# Altium project MIXR Input and Processing.PrjPcb (part 6 of 6)

## Sheet MIXR Processing - STM32 DSP Misc.SchDoc: STM32F767 DSP Microcontroller - Clock & Power
size B; Organization: Midnight Sun Solar Rayce Car Team; Address1: University of Waterloo; Address2: 200 University Ave W; Address3: Waterloo, ON, Canada; Address4: N2L 3E9; DocumentNumber: 11; SheetNumber: 11; SheetTotal: 15; Website: www.uwmidsun.com; ProjectName: ProjectName
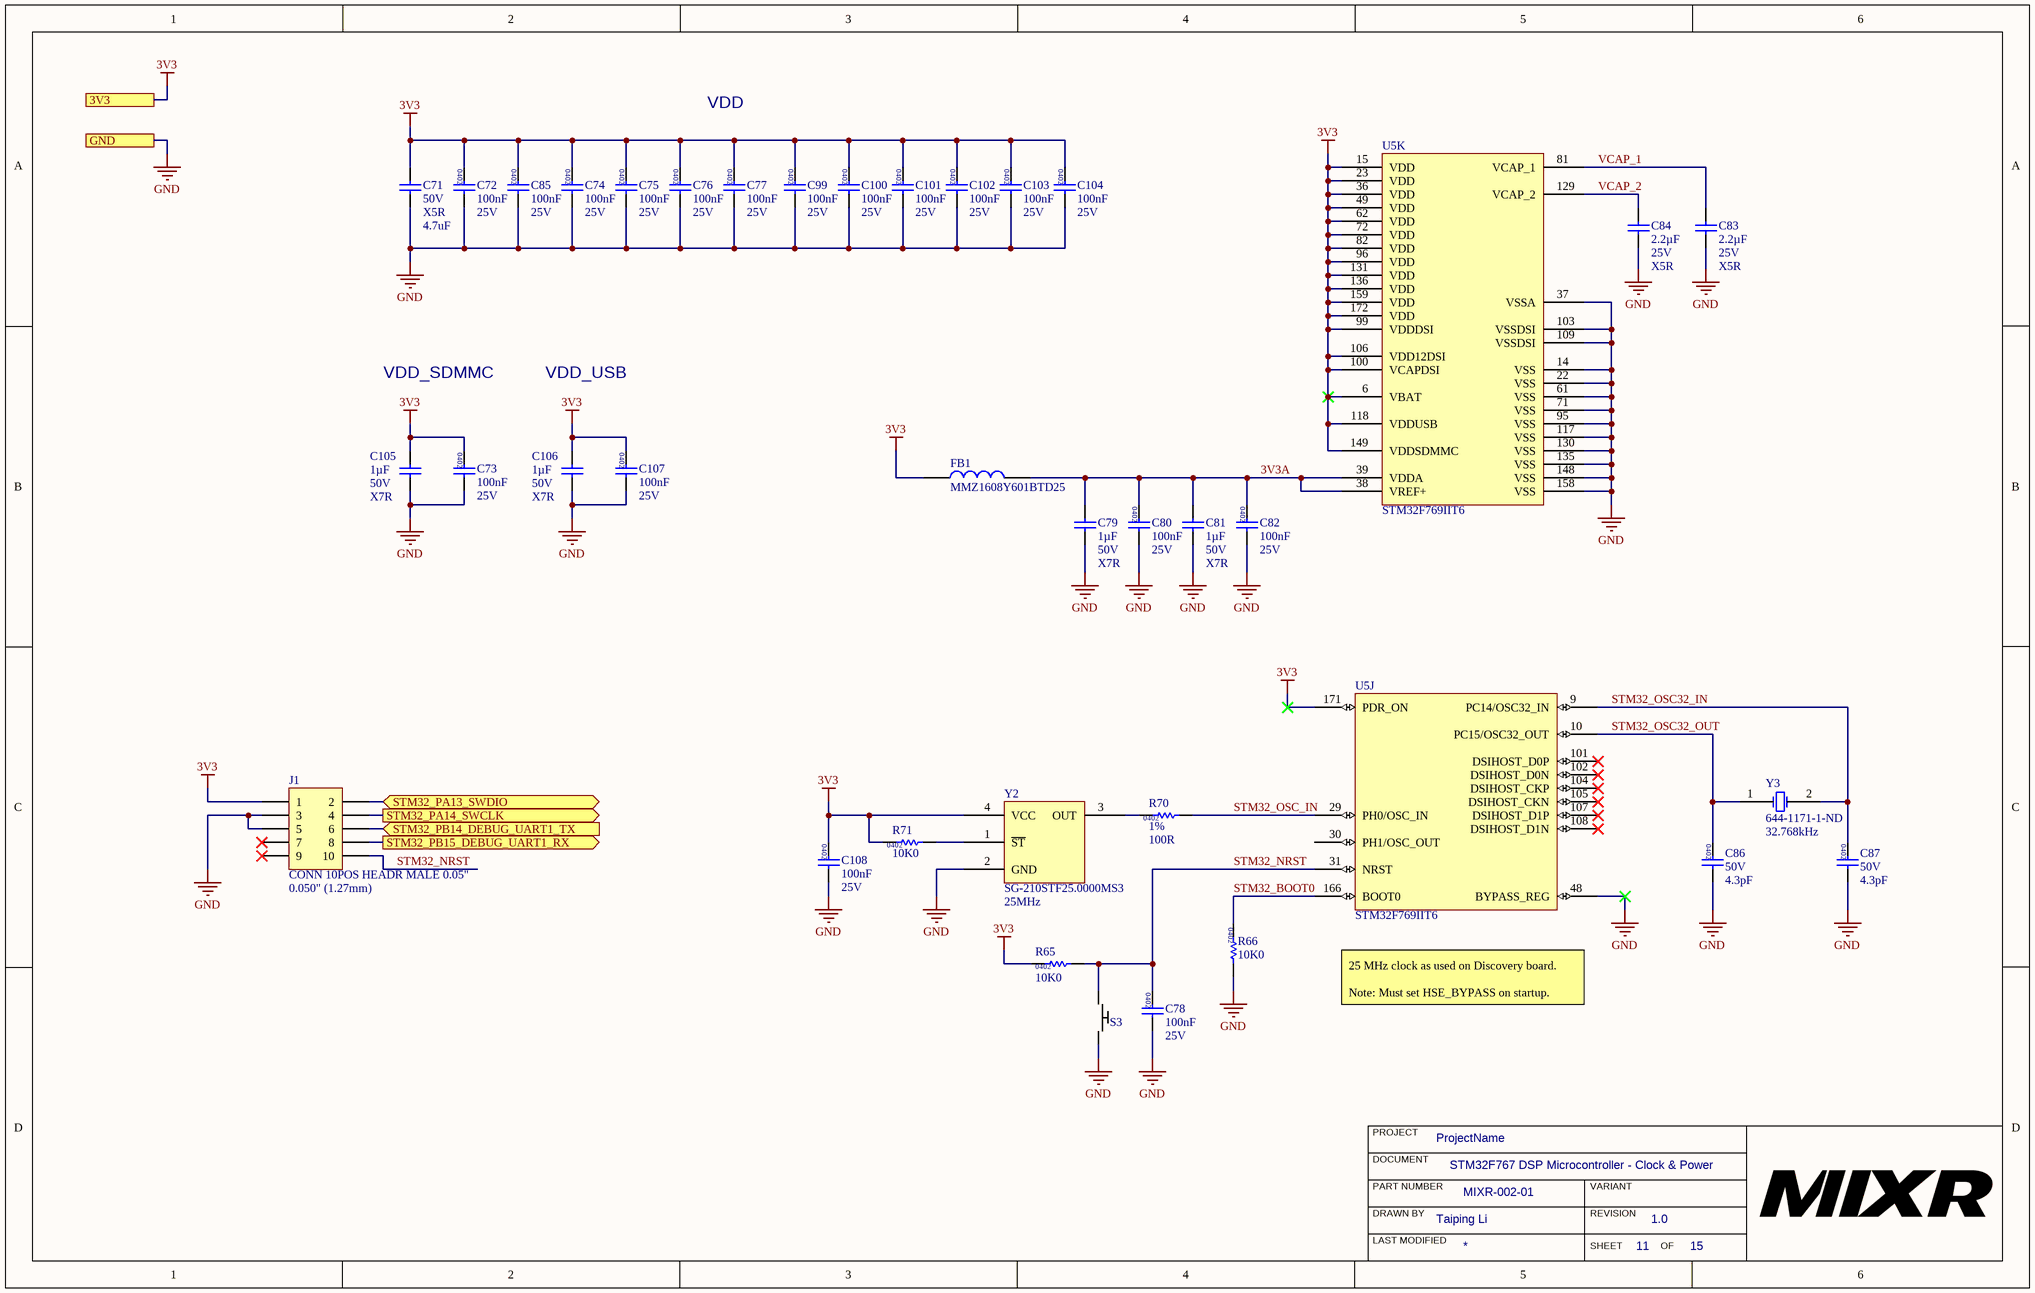
[diagram p11: MIXR Processing - STM32 DSP Misc.SchDoc]

### Parts
C71  value 4.7uF  Voltage - Rated: 50V  Temperature Coefficient: X5R  [CAP, 0805]  (hidden comment: CAP CER 4.7UF 50V 10% X5R 0805)
C72  Capacitance: 100nF  Voltage: 25V  [CAP 0402]  (hidden comment: CAP CER 0.1UF 16V X7R 0402)
C73  Capacitance: 100nF  Voltage: 25V  [CAP 0402]  (hidden comment: CAP CER 0.1UF 16V X7R 0402)
C74  Capacitance: 100nF  Voltage: 25V  [CAP 0402]  (hidden comment: CAP CER 0.1UF 16V X7R 0402)
C75  Capacitance: 100nF  Voltage: 25V  [CAP 0402]  (hidden comment: CAP CER 0.1UF 16V X7R 0402)
C76  Capacitance: 100nF  Voltage: 25V  [CAP 0402]  (hidden comment: CAP CER 0.1UF 16V X7R 0402)
C77  Capacitance: 100nF  Voltage: 25V  [CAP 0402]  (hidden comment: CAP CER 0.1UF 16V X7R 0402)
C78  Capacitance: 100nF  Voltage: 25V  [CAP 0402]  (hidden comment: CAP CER 0.1UF 16V X7R 0402)
C79  Capacitance: 1µF  Voltage: 50V  Temperature Coefficient: X7R  [CAP, 0603]  (hidden comment: CAP CER 1UF 50V 10% X7R 0603)
C80  Capacitance: 100nF  Voltage: 25V  [CAP 0402]  (hidden comment: CAP CER 0.1UF 16V X7R 0402)
C81  Capacitance: 1µF  Voltage: 50V  Temperature Coefficient: X7R  [CAP, 0603]  (hidden comment: CAP CER 1UF 50V 10% X7R 0603)
C82  Capacitance: 100nF  Voltage: 25V  [CAP 0402]  (hidden comment: CAP CER 0.1UF 16V X7R 0402)
C83  Capacitance: 2.2µF  Voltage: 25V  Temperature Coefficient: X5R  [CAP, 0603]  (hidden comment: CAP CER 2.2UF 25V 10% X5R 0603)
C84  Capacitance: 2.2µF  Voltage: 25V  Temperature Coefficient: X5R  [CAP, 0603]  (hidden comment: CAP CER 2.2UF 25V 10% X5R 0603)
C85  Capacitance: 100nF  Voltage: 25V  [CAP 0402]  (hidden comment: CAP CER 0.1UF 16V X7R 0402)
C86  Voltage Rating: 50V  Capacitance: 4.3pF  [CAP 0402]  (hidden comment: CAP CER 4.3PF 50V C0G/NPO 0402)
C87  Voltage Rating: 50V  Capacitance: 4.3pF  [CAP 0402]  (hidden comment: CAP CER 4.3PF 50V C0G/NPO 0402)
C99  Capacitance: 100nF  Voltage: 25V  [CAP 0402]  (hidden comment: CAP CER 0.1UF 16V X7R 0402)
C100  Capacitance: 100nF  Voltage: 25V  [CAP 0402]  (hidden comment: CAP CER 0.1UF 16V X7R 0402)
C101  Capacitance: 100nF  Voltage: 25V  [CAP 0402]  (hidden comment: CAP CER 0.1UF 16V X7R 0402)
C102  Capacitance: 100nF  Voltage: 25V  [CAP 0402]  (hidden comment: CAP CER 0.1UF 16V X7R 0402)
C103  Capacitance: 100nF  Voltage: 25V  [CAP 0402]  (hidden comment: CAP CER 0.1UF 16V X7R 0402)
C104  Capacitance: 100nF  Voltage: 25V  [CAP 0402]  (hidden comment: CAP CER 0.1UF 16V X7R 0402)
C105  Capacitance: 1µF  Voltage: 50V  Temperature Coefficient: X7R  [CAP, 0603]  (hidden comment: CAP CER 1UF 50V 10% X7R 0603)
C106  Capacitance: 1µF  Voltage: 50V  Temperature Coefficient: X7R  [CAP, 0603]  (hidden comment: CAP CER 1UF 50V 10% X7R 0603)
C107  Capacitance: 100nF  Voltage: 25V  [CAP 0402]  (hidden comment: CAP CER 0.1UF 16V X7R 0402)
C108  Capacitance: 100nF  Voltage: 25V  [CAP 0402]  (hidden comment: CAP CER 0.1UF 16V X7R 0402)
FB1  Manufacturer Part Number: MMZ1608Y601BTD25  [FB 0603]  (hidden comment: FB 600 OHM 1LN 0603)
J1  CONN 10POS HEADR MALE 0.05"  Pitch - Mating: 0.050" (1.27mm)  [CONN, 10POS 0.05" Debug Header]
R65  Resistance: 10K0  [RES 0402]  (hidden comment: RES 10K OHM 1% 1/16W 0402)
R66  Resistance: 10K0  [RES 0402]  (hidden comment: RES 10K OHM 1% 1/16W 0402)
R70  Tolerance: 1%  Resistance: 100R  [RES 0402]  (hidden comment: RES 100 OHM 1% 1/16W 0402)
R71  Resistance: 10K0  [RES 0402]  (hidden comment: RES 10K OHM 1% 1/16W 0402)
S3  SPST  [SW SPST-NO 0.05A 12V]  (value not drawn)
U5  Manufacturer Part Number: STM32F769IIT6  [TSQFP50P2600X2600X160-176M]  (hidden comment: IC MCU STM32F769II 176-LQFP)  (parts J,K of 11)
Y2  Manufacturer Part Number: SG-210STF25.0000MS3  Frequency: 25MHz  [CRYSTAL 25 MHz OSC XO CMOS SMD]  (hidden comment: CRYSTAL 25 MHz OSC XO CMOS SMD)
Y3  Supplier Part Number 1: 644-1171-1-ND  Frequency: 32.768kHz  [CRYSTAL 32.7680 KHZ 6PF 2-SMD]  (hidden comment: CRYSTAL 32.7680 KHZ 6PF 2-SMD)

### Ports
3V3, GND, STM32_PA13_SWDIO (bidir), STM32_PA14_SWCLK (out), STM32_PB14_DEBUG_UART1_TX (in), STM32_PB15_DEBUG_UART1_RX (out)

### Nets
3V3: C71.1 C72.1 C73.1 C74.1 C75.1 C76.1 C77.1 C85.1 C99.1 C100.1 C101.1 C102.1 C103.1 C104.1 C105.1 C106.1 C107.1 C108.1 FB1.1 J1.1 R65.1 R71.1 U5.6(VBAT) U5.15(VDD) U5.23(VDD) U5.36(VDD) U5.49(VDD) U5.62(VDD) U5.72(VDD) U5.82(VDD) U5.96(VDD) U5.99(VDDDSI) U5.100(VCAPDSI) U5.106(VDD12DSI) U5.118(VDDUSB) U5.131(VDD) U5.136(VDD) U5.149(VDDSDMMC) U5.159(VDD) U5.171(PDR_ON) U5.172(VDD) Y2.4(VCC) ; port 3V3
GND: C71.2 C72.2 C73.2 C74.2 C75.2 C76.2 C77.2 C78.2 C79.2 C80.2 C81.2 C82.2 C83.2 C84.2 C85.2 C86.2 C87.2 C99.2 C100.2 C101.2 C102.2 C103.2 C104.2 C105.2 C106.2 C107.2 C108.2 J1.3 J1.5 R66.2 S3.2 U5.14(VSS) U5.22(VSS) U5.37(VSSA) U5.48(BYPASS_REG) U5.61(VSS) U5.71(VSS) U5.95(VSS) U5.103(VSSDSI) U5.109(VSSDSI) U5.117(VSS) U5.130(VSS) U5.135(VSS) U5.148(VSS) U5.158(VSS) Y2.2(GND) ; port GND
3V3A: C79.1 C80.1 C81.1 C82.1 FB1.2 U5.38(VREF+) U5.39(VDDA)
STM32_BOOT0: R66.1 U5.166(BOOT0)
STM32_NRST: C78.1 J1.10 R65.2 S3.1 U5.31(NRST)
STM32_OSC32_IN: C87.1 U5.9(PC14/OSC32_IN) Y3.2
STM32_OSC32_OUT: C86.1 U5.10(PC15/OSC32_OUT) Y3.1
STM32_OSC_IN: R70.2 U5.29(PH0/OSC_IN)
STM32_PA13_SWDIO: J1.2 ; port STM32_PA13_SWDIO
STM32_PA14_SWCLK: J1.4 ; port STM32_PA14_SWCLK
STM32_PB14_DEBUG_UART1_TX: J1.6 ; port STM32_PB14_DEBUG_UART1_TX
STM32_PB15_DEBUG_UART1_RX: J1.8 ; port STM32_PB15_DEBUG_UART1_RX
VCAP_1: C83.1 U5.81(VCAP_1)
VCAP_2: C84.1 U5.129(VCAP_2)
NetR70_1: R70.1 Y2.3(OUT)
NetR71_2: R71.2 Y2.1(~{ST})

Not connected (* = marked no-connect by the designer): J1 7* 9*; U5 30(PH1/OSC_OUT) 101(DSIHOST_D0P)* 102(DSIHOST_D0N)* 104(DSIHOST_CKP)* 105(DSIHOST_CKN)* 107(DSIHOST_D1P)* 108(DSIHOST_D1N)*

### Notes on the sheet
- VDD
- VDD_SDMMC
- VDD_USB
- 25 MHz clock as used on Discovery board.
  Note: Must set HSE_BYPASS on startup.
- PROJECT
- DOCUMENT
- DRAWN BY
- LAST MODIFIED
- PART NUMBER
- REVISION
- SHEET
- VARIANT
- OF

### Library data of the parts
C71 = CAP CER 4.7UF 50V 10% X5R 0805: 4.7µF ±20% 50V Ceramic Capacitor X5R 0805 (2012 Metric); Manufacturer 1: Murata Electronics North America; Manufacturer Part Number 1: GRT21BR61H475ME13L; Description 1: CAP CER 4.7UF 50V X5R 0805; Supplier 1: Digi-Key; Supplier Part Number 1: 490-12395-1-ND; RoHS: RoHS Compliant; Category: Capacitors; Stock 1: 4286; Pricing 1: 1=0.56, 10=0.389, 100=0.2338, 500=0.17536, 1000=0.14808 (CAD); Packaging: Cut Tape (CT); Part Status: Active; Tolerance: ±20%; Operating Temperature: -55°C ~ 85°C; Features: -; Ratings: AEC-Q200; Applications: Automotive; Mounting Type: Surface Mount, MLCC; Package / Case: 0805 (2012 Metric); Size / Dimension: 0.079" L x 0.049" W (2.00mm x 1.25mm); Height - Seated (Max): -; Thickness (Max): 0.057" (1.45mm); Lead Spacing: -; Lead Style: -; ComponentLink1URL: http://search.murata.co.jp/Ceramy/image/img/A01X/G101/ENG/GRT21BR61H475ME13-01.pdf; ComponentLink1Description: http://search.murata.co.jp/Ceramy/image/img/A01X/G101/ENG/GRT21BR61H475ME13-01.pdf
C72-C78 C80 C82 C85 C99-C104 C107 C108 = CAP CER 0.1UF 16V X7R 0402: as C2-C7 on sheet MIXR Processing - ESP32; Supplier 1: Digi-Key; Supplier Part Number 1: 490-10698-1-ND; Packaging: Tape and Reel; ComponentLink1URL: http://www.farnell.com/datasheets/2048008.pdf?src-supplier=Farnell; ComponentLink1Description: http://www.farnell.com/datasheets/2048008.pdf?src-supplier=Farnell; Tolerance: 10%; RoHS: Yes; Category: Ceramic Capacitors; Stock 1: 785540; Pricing 1: 1=0.10000, 10=0.03400, 100=0.01520, 500=0.01088, 1000=0.00855, 2500=0.00778, 5000=0.00715 (USD); Mount: Surface Mount; Case/Package: 0402; Weight: 0.000212oz; Case Code (Metric): 1005; Case Code (Imperial): 0402; Dielectric Material: Ceramic; Min Operating Temperature: -55°C; Max Operating Temperature: 125°C; Termination: SMD/SMT; Composition: Ceramic; Package Quantity: 10000; Length: 1mm; Height: 0.5mm; Width: 0.02inch; Thickness: 0.022inch; Depth: 0.5mm; REACH SVHC: Unknown; Lead Free: Lead Free; ComponentLink2URL: http://uk.rs-online.com/webdocs/144c/0900766b8144c113.pdf?src-supplier=RSComponents; ComponentLink2Description: http://uk.rs-online.com/webdocs/144c/0900766b8144c113.pdf?src-supplier=RSComponents; ComponentLink3URL: http://www.farnell.com/datasheets/1872206.pdf?src-supplier=Farnell; ComponentLink3Description: http://www.farnell.com/datasheets/1872206.pdf?src-supplier=Farnell; ComponentLink4URL: http://components.arrow.com/part/dataview/0323_06361249?src-supplier=Arrow+Europe; ComponentLink4Description: http://components.arrow.com/part/dataview/0323_06361249?src-supplier=Arrow+Europe; ComponentLink5URL: http://www.mouser.com/ds/2/281/c02e-2905.pdf?src-supplier=Mouser; ComponentLink5Description: http://www.mouser.com/ds/2/281/c02e-2905.pdf?src-supplier=Mouser; ComponentLink6URL: http://www.farnell.com/datasheets/2048008.pdf?src-supplier=Newark; ComponentLink6Description: http://www.farnell.com/datasheets/2048008.pdf?src-supplier=Newark; ComponentLink7URL: http://psearch.en.murata.com/capacitor/product/GRM155R71E104KE14%23.pdf?src-supplier=Avnet; ComponentLink7Description: http://psearch.en.murata.com/capacitor/product/GRM155R71E104KE14%23.pdf?src-supplier=Avnet; ComponentLink8URL: https://search.murata.co.jp/Ceramy/image/img/A01X/G101/ENG/GRM155R71E104KE14-01.pdf?src-supplier=Digi-Key; ComponentLink8Description: https://search.murata.co.jp/Ceramy/image/img/A01X/G101/ENG/GRM155R71E104KE14-01.pdf?src-supplier=Digi-Key; ComponentLink9URL: http://www.farnell.com/datasheets/2048008.pdf?src-supplier=Element14; ComponentLink9Description: http://www.farnell.com/datasheets/2048008.pdf?src-supplier=Element14; Dielectric: X7R; Voltage Rating (DC): 25V; Voltage Rating: 25V
C79 C81 C105 C106 = CAP CER 1UF 50V 10% X7R 0603: 1µF ±10% 50V Ceramic Capacitor X7R 0603 (1608 Metric); Manufacturer 1: Taiyo Yuden; Manufacturer Part Number 1: UMK107AB7105KA-T; Supplier 1: Digi-Key; Supplier Part Number 1: 587-3247-1-ND; Packaging: Cut Tape (CT); Part Status: Active; Operating Temperature: -55°C ~ 125°C; Ratings: -; Mounting Type: Surface Mount, MLCC; Package / Case: 0603 (1608 Metric); Size / Dimension: 0.063" L x 0.031" W (1.60mm x 0.80mm); Height - Seated (Max): -; Thickness (Max): 0.037" (0.95mm); Lead Spacing: -; Lead Style: -; ComponentLink1URL: http://www.yuden.co.jp/productdata/catalog/en/mlcc_all_e.pdf; ComponentLink1Description: http://www.yuden.co.jp/productdata/catalog/en/mlcc_all_e.pdf; Tolerance: ±10%
C83 C84 = CAP CER 2.2UF 25V 10% X5R 0603: 2.2µF ±10% 25V Ceramic Capacitor X5R 0603 (1608 Metric); Manufacturer 1: Murata Electronics North America; Manufacturer Part Number 1: GRM188R61E225KA12D; Supplier 1: Digi-Key; Supplier Part Number 1: 490-10731-1-ND; Packaging: Cut Tape (CT); Part Status: Active; Operating Temperature: -55°C ~ 85°C; Ratings: -; Mounting Type: Surface Mount, MLCC; Package / Case: 0603 (1608 Metric); Size / Dimension: 0.063" L x 0.031" W (1.60mm x 0.80mm); Height - Seated (Max): -; Thickness (Max): 0.035" (0.90mm); Lead Spacing: -; Lead Style: -; ComponentLink1URL: http://www.murata.com/~/media/webrenewal/support/library/catalog/products/capacitor/mlcc/c02e.ashx; ComponentLink1Description: http://www.murata.com/~/media/webrenewal/support/library/catalog/products/capacitor/mlcc/c02e.ashx; Tolerance: ±10%
C86 C87 = CAP CER 4.3PF 50V C0G/NPO 0402: Multilayer Ceramic Capacitors MLCC - SMD/SMT 0402 4.3pF 50Volts C0G +/-0.1pF; Manufacturer: Murata; Manufacturer Part Number: GJM1555C1H4R3BB01D; Supplier 1: Digi-Key; RoHS: Yes; Category: Ceramic Capacitors; Stock 1: 18899; Pricing 1: 1=0.19000, 10=0.13000, 100=0.06590, 500=0.04508, 1000=0.03987, 2500=0.03814, 5000=0.03467 (USD); Mount: Surface Mount; Case/Package: 0402; Case Code (Metric): 1005; Case Code (Imperial): 0402; Min Operating Temperature: -55°C; Max Operating Temperature: 125°C; Package Quantity: 10000; Packaging: Tape and Reel; Dielectric: C0G; Voltage Rating (DC): 50V; Termination: SMD/SMT; Length: 1mm; Height: 0.5mm; Width: 0.02inch; Thickness: 0.022inch; Depth: 0.5mm; Radiation Hardening: No; ComponentLink1URL: https://datasheet.ciiva.com/11613/product-11613476.pdf?src-supplier=Avnet; ComponentLink1Description: https://datasheet.ciiva.com/11613/product-11613476.pdf?src-supplier=Avnet; ComponentLink2URL: https://datasheet.ciiva.com/29536/partnumbering-e-01-29536085.pdf?src-supplier=Digi-Key; ComponentLink2Description: https://datasheet.ciiva.com/29536/partnumbering-e-01-29536085.pdf?src-supplier=Digi-Key; ComponentLink3URL: https://datasheet.ciiva.com/29536/partnumbering-e-01-29536086.pdf?src-supplier=Digi-Key; ComponentLink3Description: https://datasheet.ciiva.com/29536/partnumbering-e-01-29536086.pdf?src-supplier=Digi-Key; Supplier Part Number 1: 490-8582-1-ND
FB1 = FB 600 OHM 1LN 0603: FERRITE BEAD 600 OHM 0603 1LN; Manufacturer: TDK; Number of Lines: 1; Max Current Rating: 500mA; DC Resistance (DCR): 400mR; Impedance: 600R; Tolerance: 25%; Test Frequency: 100MHz; Supplier 1: Digi-Key; Supplier Part Number 1: 445-172850-1-ND; RoHS: Yes; Stock 1: 19540; Pricing 1: 1 = 0.10000, 10 = 0.07600, 25 = 0.06840, 50 = 0.05000, 100 = 0.04330, 250 = 0.03416, 500 = 0.02884, 1000 = 0.02429 (USD); Mount: Surface Mount; Case/Package: 0603; Weight: 7.1E-05oz; Case Code (Metric): 1608; Case Code (Imperial): 0603; Min Operating Temperature: -55°C; Max Operating Temperature: 125°C; Package Quantity: 4000; Packaging: Tape and Reel; Termination: SMD/SMT; Max DC Current: 500mA; Length: 0.063inch; Height: 0.037inch; Width: 0.031inch; Ratings: AEC-Q200
J1 = CONN 10POS HEADR MALE 0.05": 10 Positions Header Connector 0.050" (1.27mm) Surface Mount Gold; Manufacturer 1: Amphenol FCI; Manufacturer Part Number 1: 20021121-00010C4LF; Style: Board to Board; Shrouding: Unshrouded; Number of Positions: 10; Number of Positions Loaded: All; Contact Length - Mating: 0.120" (3.05mm); Material Flammability Rating: UL94 V-0; Supplier 1: Digi-Key; Supplier Part Number 1: 609-3695-1-ND; Packaging: Cut Tape (CT); Part Status: Active; Connector Type: Header; Contact Type: Male Pin; Number of Rows: 2; Row Spacing - Mating: 0.050" (1.27mm); Mounting Type: Surface Mount; Termination: Solder; Fastening Type: -; Contact Length - Post: -; Overall Contact Length: -; Insulation Height: -; Contact Shape: Square; Contact Finish - Mating: Gold; Contact Finish Thickness - Mating: 10µin (0.25µm); Contact Finish - Post: Tin; Contact Material: Copper Alloy; Insulation Material: Thermoplastic; Operating Temperature: -; Ingress Protection: -; Insulation Color: Black; Current Rating: -; Mated Stacking Heights: -; Contact Finish Thickness - Post: 50µin (1.27µm); ComponentLink1URL: http://portal.fciconnect.com/Comergent//fci/drawing/20021121.pdf; ComponentLink1Description: http://portal.fciconnect.com/Comergent//fci/drawing/20021121.pdf; Voltage: -
R65 R66 R71 = RES 10K OHM 1% 1/16W 0402: Surface Mount Thick Film Resistor, Rc Series, 10 Kohm, 62.5 Mw, - 1%, 50 V, 0402 [1005 Metric]; Manufacturer: Yageo; Manufacturer Part Number: RC0402FR-0710KL; Temperature Coefficient: 100ppm/°C; Voltage Rating: 50V; Power Rating: 62.5mW; Supplier 1: Digi-Key; Supplier Part Number 1: 311-10.0KLRCT-ND; Packaging: Tape and Reel; Composition: Thick Film; ComponentLink1URL: https://datasheet.ciiva.com/7660/38568-7660787.pdf?src-supplier=Element14; ComponentLink1Description: https://datasheet.ciiva.com/7660/38568-7660787.pdf?src-supplier=Element14; Tolerance: 1%; RoHS: Yes; Category: Chip SMD Resistors; Stock 1: 60761136; Pricing 1: 1=0.10000, 10=0.01600, 100=0.00640, 1000=0.00289, 2500=0.00251, 5000=0.00207 (USD); Case/Package: 0402; Number of Pins: 2; Case Code (Imperial): 0402; Case Code (Metric): 1005; Min Operating Temperature: -55°C; Max Operating Temperature: 155°C; Voltage Rating (DC): 50V; Termination: SMD/SMT; Military Standard: Not; Working Voltage: 50V; Number of Terminations: 2; Length: 1mm; Height: 0.32mm; Width: 0.5mm; Depth: 0.5mm; Lead Pitch: 0.2mm; REACH SVHC: No SVHC; Lead Free: Lead Free; ComponentLink2URL: https://datasheet.ciiva.com/7983/1018594-7983486.pdf?src-supplier=Element14; ComponentLink2Description: https://datasheet.ciiva.com/7983/1018594-7983486.pdf?src-supplier=Element14; ComponentLink3URL: https://datasheet.ciiva.com/7849/1784430-7849813.pdf?src-supplier=Element14; ComponentLink3Description: https://datasheet.ciiva.com/7849/1784430-7849813.pdf?src-supplier=Element14; ComponentLink4URL: https://datasheet.ciiva.com/7849/1686128-7849814.pdf?src-supplier=Element14; ComponentLink4Description: https://datasheet.ciiva.com/7849/1686128-7849814.pdf?src-supplier=Element14; ComponentLink5URL: https://datasheet.ciiva.com/7849/1784430-7849815.pdf?src-supplier=Element14; ComponentLink5Description: https://datasheet.ciiva.com/7849/1784430-7849815.pdf?src-supplier=Element14; ComponentLink6URL: https://datasheet.ciiva.com/22747/1018594-22747512.pdf?src-supplier=Element14; ComponentLink6Description: https://datasheet.ciiva.com/22747/1018594-22747512.pdf?src-supplier=Element14; ComponentLink7URL: https://datasheet.ciiva.com/12667/pyu-rc0402-51-rohs-l-6-r-12667067.pdf?src-supplier=Mouser; ComponentLink7Description: https://datasheet.ciiva.com/12667/pyu-rc0402-51-rohs-l-6-r-12667067.pdf?src-supplier=Mouser
R70 = RES 100 OHM 1% 1/16W 0402: 100 Ohms ±1% 0.063W, 1/16W Chip Resistor 0402 (1005 Metric) Moisture Resistant Thick Film; Manufacturer: Yageo; Manufacturer Part Number: RC0402FR-07100RL; Power Rating: 62.5mW; Voltage Rating: 50V; Temperature Coefficient: 100ppm/°C; Supplier 1: Digi-Key; RoHS: Yes; Category: Chip SMD Resistors; Stock 1: 42351567; Pricing 1: 1=0.10000, 10=0.01600, 100=0.00640, 1000=0.00289, 2500=0.00251, 5000=0.00207 (USD); Case/Package: 0402; Number of Pins: 2; Case Code (Imperial): 0402; Case Code (Metric): 1005; Min Operating Temperature: -55°C; Max Operating Temperature: 155°C; Packaging: Tape and Reel; Termination: SMD/SMT; Composition: Thick Film; Military Standard: Not; Voltage Rating (DC): 50V; Length: 1mm; Height: 0.32mm; Depth: 0.5mm; Width: 0.5mm; REACH SVHC: No SVHC; Lead Free: Lead Free; ComponentLink1URL: https://datasheet.ciiva.com/7849/1784430-7849810.pdf?src-supplier=Element14; ComponentLink1Description: https://datasheet.ciiva.com/7849/1784430-7849810.pdf?src-supplier=Element14; ComponentLink2URL: https://datasheet.ciiva.com/11808/0900766b80c66297-11808765.pdf?src-supplier=RSComponents; ComponentLink2Description: https://datasheet.ciiva.com/11808/0900766b80c66297-11808765.pdf?src-supplier=RSComponents; ComponentLink3URL: https://datasheet.ciiva.com/22747/1018594-22747511.pdf?src-supplier=Element14; ComponentLink3Description: https://datasheet.ciiva.com/22747/1018594-22747511.pdf?src-supplier=Element14; ComponentLink4URL: https://datasheet.ciiva.com/12667/pyu-rc0402-51-rohs-l-6-r-12667957.pdf?src-supplier=Mouser; ComponentLink4Description: https://datasheet.ciiva.com/12667/pyu-rc0402-51-rohs-l-6-r-12667957.pdf?src-supplier=Mouser; ComponentLink5URL: https://datasheet.ciiva.com/16740/pyu-rc0402-51-rohs-l-6-r-16740566.pdf?src-supplier=Future+Electronics; ComponentLink5Description: https://datasheet.ciiva.com/16740/pyu-rc0402-51-rohs-l-6-r-16740566.pdf?src-supplier=Future+Electronics; ComponentLink6URL: https://datasheet.ciiva.com/15189/getdatasheetpartid-329466-15189335.pdf?src-supplier=Verical; ComponentLink6Description: https://datasheet.ciiva.com/15189/getdatasheetpartid-329466-15189335.pdf?src-supplier=Verical; ComponentLink7URL: https://datasheet.ciiva.com/28367/1018594-28367226.pdf?src-supplier=Element14; ComponentLink7Description: https://datasheet.ciiva.com/28367/1018594-28367226.pdf?src-supplier=Element14; Supplier Part Number 1: 311-100LRCT-ND
S3 = SW SPST-NO 0.05A 12V: SWITCH TACTILE SPST-NO 50MA 12V; Manufacturer: E-Switch; Manufacturer Part Number: TL3305AF260QG; Mechanical Life: 200000Cycles; Illumination Type: Non-Illuminated; Operating Force: 260gf; Switch Travel: 0.2mm; Switch Function: Off-Mom; Actuator Type: Standard; Supplier 1: Digi-Key; RoHS: Yes; Category: Tactile Switches; Stock 1: 10795; Pricing 1: 1=0.20000, 10=0.19500, 25=0.18800, 50=0.18120, 100=0.17110, 250=0.16104, 500=0.15434, 1000=0.11743 (USD); Mount: Surface Mount; Min Operating Temperature: -20°C; Max Operating Temperature: 70°C; Packaging: Tape and Reel; Termination: Gull Wing; Throw Configuration: SPST; Lead Free: Lead Free; ComponentLink1URL: http://www.farnell.com/datasheets/2554191.pdf?src-supplier=Farnell; ComponentLink1Description: http://www.farnell.com/datasheets/2554191.pdf?src-supplier=Farnell; ComponentLink2URL: http://spec_sheets.e-switch.com/specs/P010471.pdf?src-supplier=Newark; ComponentLink2Description: http://spec_sheets.e-switch.com/specs/P010471.pdf?src-supplier=Newark; ComponentLink3URL: http://spec_sheets.e-switch.com/specs/P010471.pdf?src-supplier=Future+Electronics; ComponentLink3Description: http://spec_sheets.e-switch.com/specs/P010471.pdf?src-supplier=Future+Electronics; ComponentLink4URL: http://spec_sheets.e-switch.com/specs/P010471.pdf?src-supplier=Digi-Key; ComponentLink4Description: http://spec_sheets.e-switch.com/specs/P010471.pdf?src-supplier=Digi-Key; ComponentLink5URL: http://spec_sheets.e-switch.com/specs/P010471.pdf?src-supplier=Mouser; ComponentLink5Description: http://spec_sheets.e-switch.com/specs/P010471.pdf?src-supplier=Mouser; ComponentLink6URL: http://spec_sheets.e-switch.com/specs/P010471.pdf?src-supplier=NAC+Semi; ComponentLink6Description: http://spec_sheets.e-switch.com/specs/P010471.pdf?src-supplier=NAC+Semi; Supplier Part Number 1: EG5353CT-ND
U5 = IC MCU STM32F769II 176-LQFP: ARM® Cortex®-M7 STM32F7 Microcontroller IC 32-Bit 216MHz 2MB (2M x 8) FLASH 176-LQFP (24x24); Manufacturer: STMicroelectronics; Supplier 1: Digi-Key; RoHS: No; Category: Microcontrollers; Stock 1: 295; Pricing 1: 1=12.69000, 10=11.66300, 25=11.18000, 100=9.85040, 250=9.36696, 500=8.76264, 1000=8.03746 (USD); ComponentLink1URL: http://www.st.com/content/ccc/resource/technical/document/errata_sheet/group0/23/a6/11/0b/30/24/46/a5/DM00257543/files/DM00257543.pdf/jcr:content/translations/en.DM00257543.pdf?src-supplier=Digi-Key; ComponentLink1Description: http://www.st.com/content/ccc/resource/technical/document/errata_sheet/group0/23/a6/11/0b/30/24/46/a5/DM00257543/files/DM00257543.pdf/jcr:content/translations/en.DM00257543.pdf?src-supplier=Digi-Key; Supplier Part Number 1: 497-16649-ND
Y2 = CRYSTAL 25 MHz OSC XO CMOS SMD: XTAL OSC XO 25.0000MHZ CMOS SMD; Manufacturer: Epson; Max Supply Current: 2.2mA; Frequency Stability: 25ppm; Load Capacitance: 15pF; Min Supply Voltage: 1.6V; Max Supply Voltage: 3.6V; Max Duty Cycle: 55%; Supplier 1: Digi-Key; RoHS: Yes; Category: Oscillators; Stock 1: 1693; Pricing 1: 1=1.21000, 10=1.15900, 50=1.13200, 100=0.97020 (USD); Mount: Surface Mount; Case/Package: SMD/SMT; Min Operating Temperature: -20°C; Max Operating Temperature: 70°C; Package Quantity: 250; Packaging: Tape and Reel; Termination: SMD/SMT; Current Rating: 2.2mA; Length: 0.098inch; Height: 0.035inch; Width: 0.079inch; Lead Free: Lead Free; ComponentLink1URL: https://datasheet.ciiva.com/29629/029-sg-210stf-e147-29629845.pdf?src-supplier=Digi-Key; ComponentLink1Description: https://datasheet.ciiva.com/29629/029-sg-210stf-e147-29629845.pdf?src-supplier=Digi-Key; ComponentLink2URL: https://datasheet.ciiva.com/29629/029-sg-210stf-e147-29629799.pdf?src-supplier=Digi-Key; ComponentLink2Description: https://datasheet.ciiva.com/29629/029-sg-210stf-e147-29629799.pdf?src-supplier=Digi-Key; ComponentLink3URL: https://datasheet.ciiva.com/29629/029-sg-210stf-e147-29629798.pdf?src-supplier=Digi-Key; ComponentLink3Description: https://datasheet.ciiva.com/29629/029-sg-210stf-e147-29629798.pdf?src-supplier=Digi-Key; Supplier Part Number 1: SER3804CT-ND
Y3 = CRYSTAL 32.7680 KHZ 6PF 2-SMD: Crystal 32.7680KHZ 6PF SMD; Manufacturer: NDK; Manufacturer Part Number: NX3215SA-32.768K-STD-MUA-14; Frequency Tolerance: 20ppm; ESR (Equivalent Series Resistance): 70kR; Supplier 1: Digi-Key; RoHS: Yes; Category: Crystals; Stock 1: 61958; Pricing 1: 1=0.68000, 10=0.60200, 50=0.56280, 100=0.49740, 500=0.47124, 1000=0.39270 (USD); Mount: Surface Mount; Case/Package: SMD/SMT; Number of Pins: 2; Min Operating Temperature: -40°C; Max Operating Temperature: 85°C; Packaging: Tape and Reel; Package Quantity: 3000; Length: 0.126inch; Height: 0.035inch; Width: 0.059inch; ComponentLink1URL: https://datasheet.ciiva.com/6733/c-nx3215sa-std-mua-9-e-6733110.pdf?src-supplier=Digi-Key; ComponentLink1Description: https://datasheet.ciiva.com/6733/c-nx3215sa-std-mua-9-e-6733110.pdf?src-supplier=Digi-Key; ComponentLink2URL: https://datasheet.ciiva.com/6733/c-nx3215sa-std-mua-9-e-6733111.pdf?src-supplier=Digi-Key; ComponentLink2Description: https://datasheet.ciiva.com/6733/c-nx3215sa-std-mua-9-e-6733111.pdf?src-supplier=Digi-Key; ComponentLink3URL: https://datasheet.ciiva.com/6733/c-nx3215sa-std-mua-9-e-6733112.pdf?src-supplier=Digi-Key; ComponentLink3Description: https://datasheet.ciiva.com/6733/c-nx3215sa-std-mua-9-e-6733112.pdf?src-supplier=Digi-Key; Load Capacitance: 6pF

## Sheet MIXR Input - Board to Board Connectors.SchDoc: Processing & Power Board Connector
size B; Organization: Midnight Sun Solar Rayce Car Team; Address1: University of Waterloo; Address2: 200 University Ave W; Address3: Waterloo, ON, Canada; Address4: N2L 3E9; DocumentNumber: 3; SheetNumber: 3; SheetTotal: 15; Website: www.uwmidsun.com; ProjectName: ProjectName
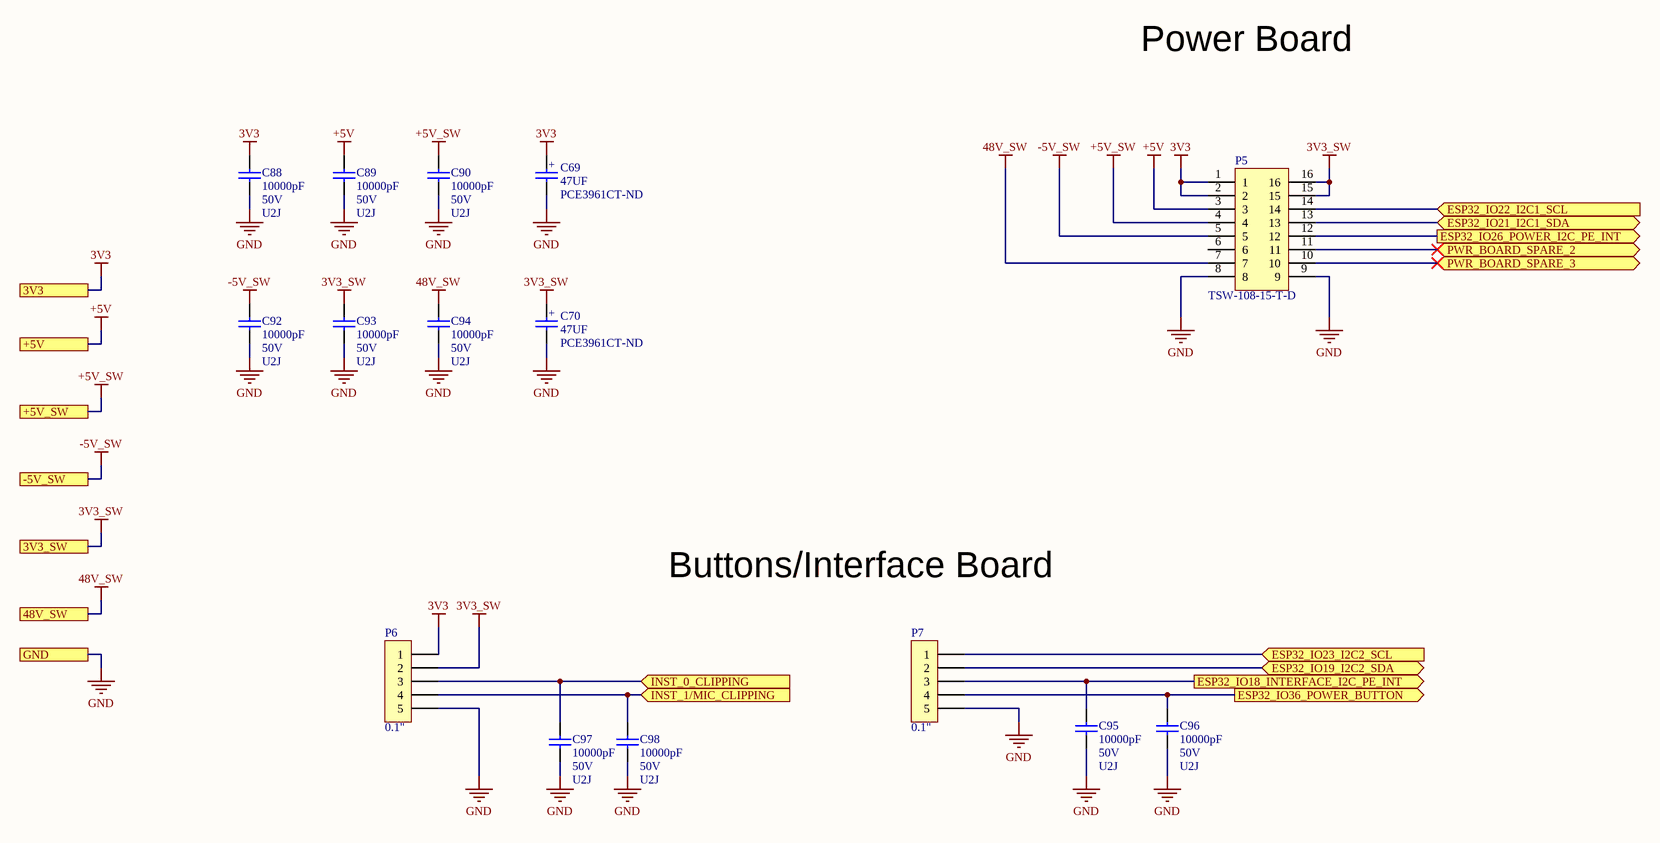
[diagram p12: MIXR Input - Board to Board Connectors.SchDoc]

### Parts
C69  47UF  Supplier Part Number 1: PCE3961CT-ND  [CAP ALUM 6.3MM RADIAL SMD]
C70  47UF  Supplier Part Number 1: PCE3961CT-ND  [CAP ALUM 6.3MM RADIAL SMD]
C88  Capacitance: 10000pF  Voltage: 50V  Temperature Coefficient: U2J  [CAP, 0603]  (hidden comment: CAP CER 10nF 50V 5% X7R 0603)
C89  Capacitance: 10000pF  Voltage: 50V  Temperature Coefficient: U2J  [CAP, 0603]  (hidden comment: CAP CER 10nF 50V 5% X7R 0603)
C90  Capacitance: 10000pF  Voltage: 50V  Temperature Coefficient: U2J  [CAP, 0603]  (hidden comment: CAP CER 10nF 50V 5% X7R 0603)
C92  Capacitance: 10000pF  Voltage: 50V  Temperature Coefficient: U2J  [CAP, 0603]  (hidden comment: CAP CER 10nF 50V 5% X7R 0603)
C93  Capacitance: 10000pF  Voltage: 50V  Temperature Coefficient: U2J  [CAP, 0603]  (hidden comment: CAP CER 10nF 50V 5% X7R 0603)
C94  Capacitance: 10000pF  Voltage: 50V  Temperature Coefficient: U2J  [CAP, 0603]  (hidden comment: CAP CER 10nF 50V 5% X7R 0603)
C95  Capacitance: 10000pF  Voltage: 50V  Temperature Coefficient: U2J  [CAP, 0603]  (hidden comment: CAP CER 10nF 50V 5% X7R 0603)
C96  Capacitance: 10000pF  Voltage: 50V  Temperature Coefficient: U2J  [CAP, 0603]  (hidden comment: CAP CER 10nF 50V 5% X7R 0603)
C97  Capacitance: 10000pF  Voltage: 50V  Temperature Coefficient: U2J  [CAP, 0603]  (hidden comment: CAP CER 10nF 50V 5% X7R 0603)
C98  Capacitance: 10000pF  Voltage: 50V  Temperature Coefficient: U2J  [CAP, 0603]  (hidden comment: CAP CER 10nF 50V 5% X7R 0603)
P5  Manufacturer Part Number: TSW-108-15-T-D  [CONN, 16POS 0.100" 0.73" MALE]  (hidden comment: CONN 16POS HEADER 0.1" 0.73" MALE)
P6  0.1"  [CONN, 5POS 1.23" 0.100" MALE Header]
P7  0.1"  [CONN, 5POS 1.23" 0.100" MALE Header]

### Ports
3V3, 3V3_SW, 48V_SW, +5V, +5V_SW, -5V_SW, ESP32_IO18_INTERFACE_I2C_PE_INT (out), ESP32_IO19_I2C2_SDA (bidir), ESP32_IO21_I2C1_SDA (bidir), ESP32_IO22_I2C1_SCL (in), ESP32_IO23_I2C2_SCL (in), ESP32_IO26_POWER_I2C_PE_INT (out), ESP32_IO36_POWER_BUTTON (out), GND, INST_0_CLIPPING (in), INST_1/MIC_CLIPPING (in), PWR_BOARD_SPARE_2 (bidir), PWR_BOARD_SPARE_3 (bidir)

### Nets
3V3: C69.1 C88.1 P5.1 P5.2 P6.1 ; port 3V3
3V3_SW: C70.1 C93.1 P5.15 P5.16 P6.2 ; port 3V3_SW
48V_SW: C94.1 P5.7 ; port 48V_SW
+5V: C89.1 P5.3 ; port +5V
+5V_SW: C90.1 P5.4 ; port +5V_SW
-5V_SW: C92.1 P5.5 ; port -5V_SW
GND: C69.2 C70.2 C88.2 C89.2 C90.2 C92.2 C93.2 C94.2 C95.2 C96.2 C97.2 C98.2 P5.8 P5.9 P6.5 P7.5 ; port GND
ESP32_IO18_INTERFACE_I2C_PE_INT: C95.1 P7.3 ; port ESP32_IO18_INTERFACE_I2C_PE_INT
ESP32_IO19_I2C2_SDA: P7.2 ; port ESP32_IO19_I2C2_SDA
ESP32_IO21_I2C1_SDA: P5.13 ; port ESP32_IO21_I2C1_SDA
ESP32_IO22_I2C1_SCL: P5.14 ; port ESP32_IO22_I2C1_SCL
ESP32_IO23_I2C2_SCL: P7.1 ; port ESP32_IO23_I2C2_SCL
ESP32_IO26_POWER_I2C_PE_INT: P5.12 ; port ESP32_IO26_POWER_I2C_PE_INT
ESP32_IO36_POWER_BUTTON: C96.1 P7.4 ; port ESP32_IO36_POWER_BUTTON
INST_0_CLIPPING: C97.1 P6.3 ; port INST_0_CLIPPING
INST_1/MIC_CLIPPING: C98.1 P6.4 ; port INST_1/MIC_CLIPPING
PWR_BOARD_SPARE_2: P5.11 ; port PWR_BOARD_SPARE_2
PWR_BOARD_SPARE_3: P5.10 ; port PWR_BOARD_SPARE_3

Not connected (* = marked no-connect by the designer): P5 6

### Notes on the sheet
- Power Board
- Buttons/Interface Board
- PROJECT
- DOCUMENT
- DRAWN BY
- LAST MODIFIED
- PART NUMBER
- REVISION
- SHEET
- VARIANT
- OF
- (in symbol CAP ALUM 47UF 20% 35V SMD) +

### Library data of the parts
C69 C70 = CAP ALUM 47UF 20% 35V SMD: 47µF 35V Aluminum Electrolytic Capacitors Radial, Can - SMD 1000 Hrs @ 85°C; Manufacturer: Panasonic; Manufacturer Part Number: EEE-1VA470WP; Tolerance: 20%; Ripple Current: 70mA; Life (Hours): 1000Hour; Supplier 1: Digi-Key; Stock 1: 2820; Pricing 1: 1=0.38, 10=0.263, 100=0.1579, 500=0.11846 (USD); Mount: Surface Mount,PCB; Case/Package: Radial; Contact Plating: Tin; Min Operating Temperature: -40°C; Max Operating Temperature: 85°C; Capacitance: 47uF; Voltage Rating (DC): 35V; Voltage Rating: 35V; Packaging: Tape and Reel; Package Quantity: 1; Ripple Current (AC): 70mA; Termination: SMD/SMT; Diameter: 6.3mm; Length: 5.5mm; Height: 5.4mm; Height - Seated (Max): 0.213inch; Radiation Hardening: No; REACH SVHC: Unknown; Lead Free: Lead Free; ComponentLink1URL: https://datasheet.ciiva.com/2983/aba0000ce2-2983926.pdf; ComponentLink1Description: https://datasheet.ciiva.com/2983/aba0000ce2-2983926.pdf; ComponentLink2URL: https://datasheet.ciiva.com/2983/aba0000ce2-2983927.pdf; ComponentLink2Description: https://datasheet.ciiva.com/2983/aba0000ce2-2983927.pdf; ComponentLink3URL: https://datasheet.ciiva.com/14598/70255710-14598937.pdf; ComponentLink3Description: https://datasheet.ciiva.com/14598/70255710-14598937.pdf; ComponentLink4URL: https://datasheet.ciiva.com/15165/getdatasheetpartid-86239-15165868.pdf; ComponentLink4Description: https://datasheet.ciiva.com/15165/getdatasheetpartid-86239-15165868.pdf; ComponentLink5URL: https://datasheet.ciiva.com/16507/aba0000ce2-16507965.pdf; ComponentLink5Description: https://datasheet.ciiva.com/16507/aba0000ce2-16507965.pdf; ComponentLink6URL: https://datasheet.ciiva.com/30206/11aba0000ce2-30206253.pdf; ComponentLink6Description: https://datasheet.ciiva.com/30206/11aba0000ce2-30206253.pdf
C88-C90 C92-C98 = CAP CER 10nF 50V 5% X7R 0603: 10000pF ±5% 50V Ceramic Capacitor U2J 0603 (1608 Metric); Manufacturer 1: KEMET; Manufacturer Part Number 1: C0603C103J5JAC7867; Supplier 1: Digi-Key; Supplier Part Number 1: 399-13384-1-ND; Packaging: Cut Tape (CT); Part Status: Active; Operating Temperature: -55°C ~ 125°C; Ratings: -; Failure Rate: -; Mounting Type: Surface Mount, MLCC; Package / Case: 0603 (1608 Metric); Size / Dimension: 0.063" L x 0.032" W (1.60mm x 0.80mm); Height - Seated (Max): -; Thickness (Max): 0.034" (0.87mm); Lead Spacing: -; Lead Style: -; ComponentLink1URL: http://www.kemet.com/docfinder?Partnumber=C0603C103J5JAC7867; ComponentLink1Description: http://www.kemet.com/docfinder?Partnumber=C0603C103J5JAC7867; Tolerance: ±5%
P5 = CONN 16POS HEADER 0.1" 0.73" MALE: SAMTEC         TSW-108-15-T-D             Board-To-Board Connector, Vertical, TSW Series, 16 Contacts, Header, 2.54 mm, Through Hole, 2 Rows; Max Current Rating: 7.6A; Number of Contacts: 16; Max Voltage Rating (AC): 550V; Pitch: 2.54mm; Supplier 1: Digi-Key; Supplier Part Number 1: SAM12336-ND; Packaging: Bulk; Number of Rows: 2; Termination: Solder; Contact Material: Bronze; ComponentLink1URL: https://datasheet.ciiva.com/15175/getdatasheetpartid-51138-15175898.pdf?src-supplier=Verical; ComponentLink1Description: https://datasheet.ciiva.com/15175/getdatasheetpartid-51138-15175898.pdf?src-supplier=Verical; Manufacturer: Samtec; RoHS: Yes; Category: Headers and Wire Housings; Stock 1: 387; Pricing 1: 1=1.02000, 10=0.89800, 100=0.77440, 500=0.63360, 1000=0.56320, 5000=0.49280, 10000=0.46816 (USD); Contact Plating: Tin; Housing Color: Black; Housing Material: Polyester; Min Operating Temperature: -55°C; Max Operating Temperature: 105°C; Orientation: Straight; Gender: Male; Length: 20.32mm; Depth: 5.08mm; Radiation Hardening: No; REACH SVHC: No SVHC
P6 P7 = CONN 5POS 0.1" 1" MALE HEADER: CONN HEADER 5POS .100" SNGL; Manufacturer: Samtec; Manufacturer Part Number: TSW-105-20-T-S; Number of Positions: 5; Gender: Male; Connector Type: Male Pin; Pitch: 0.1inch; System: Connector; RoHS: Yes; Category: Headers and Wire Housings; Stock 1: 939; Pricing 1: 1=0.45000, 10=0.42300, 100=0.32430, 500=0.28200, 1000=0.23265, 5000=0.20445, 10000=0.19035 (USD); Mount: Through Hole; Color: Black; Contact Plating: Tin; Contact Material: Bronze; Package Quantity: 1; Number of Rows: 1; Packaging: Rail/Tube; Termination: Solder; Number of Contacts: 5; Contact Mating Length: 1.02inch; Radiation Hardening: No; REACH SVHC: No SVHC; Lead Free: Lead Free; ComponentLink1URL: https://datasheet.ciiva.com/739/tsw-xxx-xx-xxx-x-xx-xxx-mkt-739939.pdf?src-supplier=Digi-Key; ComponentLink1Description: https://datasheet.ciiva.com/739/tsw-xxx-xx-xxx-x-xx-xxx-mkt-739939.pdf?src-supplier=Digi-Key; ComponentLink2URL: https://datasheet.ciiva.com/29947/htsw-th-29947990.pdf?src-supplier=Avnet; ComponentLink2Description: https://datasheet.ciiva.com/29947/htsw-th-29947990.pdf?src-supplier=Avnet; Supplier 1: Digi-Key; Supplier Part Number 1: SAM9000-ND

## Sheet MIXR Processing - STM32 NOR Flash.SchDoc: Title
size B; Organization: Midnight Sun Solar Rayce Car Team; Address1: University of Waterloo; Address2: 200 University Ave W; Address3: Waterloo, ON, Canada; Address4: N2L 3E9; DocumentNumber: 12; SheetNumber: 12; SheetTotal: 15; Website: www.uwmidsun.com; ProjectName: ProjectName
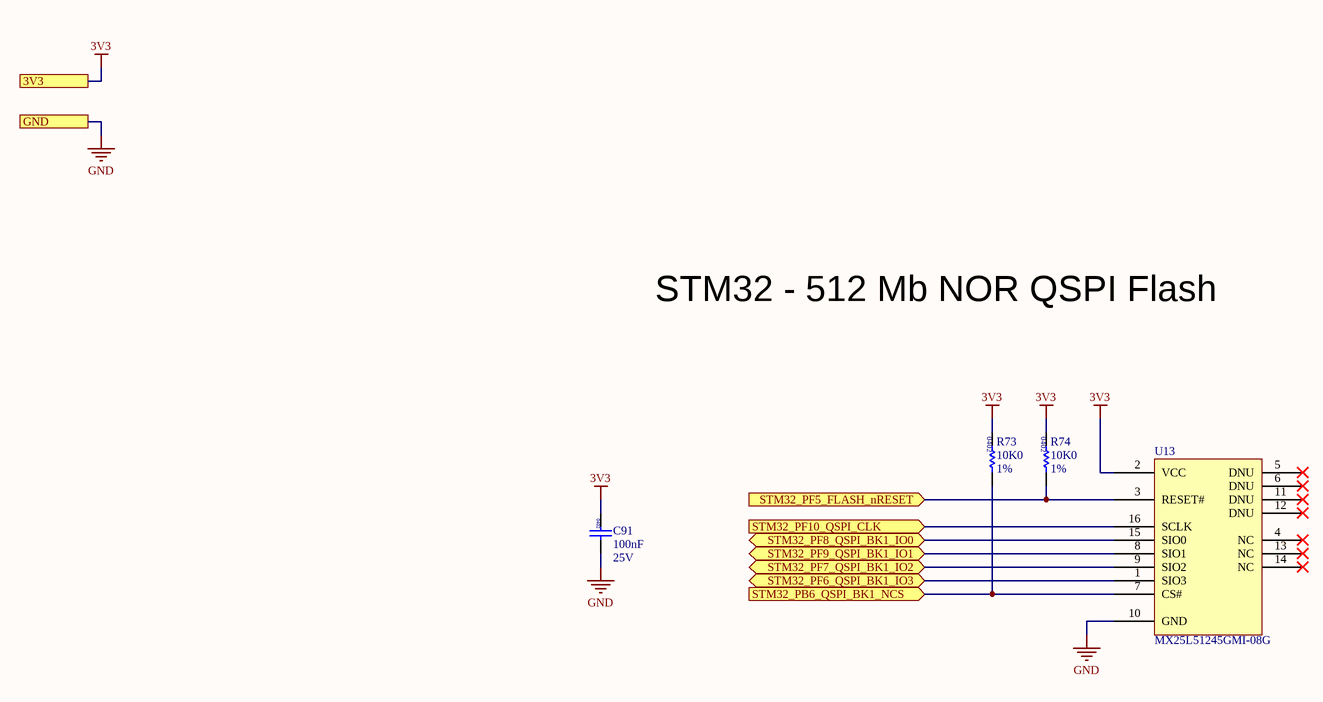
[diagram p13: MIXR Processing - STM32 NOR Flash.SchDoc]

### Parts
C91  Capacitance: 100nF  Voltage: 25V  [CAP 0402]  (hidden comment: CAP CER 0.1UF 16V X7R 0402)
R73  Resistance: 10K0  Tolerance: 1%  [RES 0402]  (hidden comment: RES 10K OHM 1% 1/16W 0402)
R74  Resistance: 10K0  Tolerance: 1%  [RES 0402]  (hidden comment: RES 10K OHM 1% 1/16W 0402)
U13  Manufacturer Part Number: MX25L51245GMI-08G  [SOP127P1030X265-16N]  (hidden comment: IC FLASH NOR 512Mb SPI 166MHz 16-SOP)

### Ports
3V3, GND, STM32_PB6_QSPI_BK1_NCS (in), STM32_PF5_FLASH_nRESET (in), STM32_PF6_QSPI_BK1_IO3 (bidir), STM32_PF7_QSPI_BK1_IO2 (bidir), STM32_PF8_QSPI_BK1_IO0 (bidir), STM32_PF9_QSPI_BK1_IO1 (bidir), STM32_PF10_QSPI_CLK (in)

### Nets
3V3: C91.1 R73.1 R74.1 U13.2(VCC) ; port 3V3
GND: C91.2 U13.10(GND) ; port GND
STM32_PB6_QSPI_BK1_NCS: R73.2 U13.7(CS#) ; port STM32_PB6_QSPI_BK1_NCS
STM32_PF5_FLASH_nRESET: R74.2 U13.3(RESET#) ; port STM32_PF5_FLASH_nRESET
STM32_PF6_QSPI_BK1_IO3: U13.1(SIO3) ; port STM32_PF6_QSPI_BK1_IO3
STM32_PF7_QSPI_BK1_IO2: U13.9(SIO2) ; port STM32_PF7_QSPI_BK1_IO2
STM32_PF8_QSPI_BK1_IO0: U13.15(SIO0) ; port STM32_PF8_QSPI_BK1_IO0
STM32_PF9_QSPI_BK1_IO1: U13.8(SIO1) ; port STM32_PF9_QSPI_BK1_IO1
STM32_PF10_QSPI_CLK: U13.16(SCLK) ; port STM32_PF10_QSPI_CLK

Not connected (* = marked no-connect by the designer): U13 4(NC)* 5(DNU)* 6(DNU)* 11(DNU)* 12(DNU)* 13(NC)* 14(NC)*

### Notes on the sheet
- STM32 - 512 Mb NOR QSPI Flash
- PROJECT
- DOCUMENT
- DRAWN BY
- LAST MODIFIED
- PART NUMBER
- REVISION
- SHEET
- VARIANT
- OF

### Library data of the parts
C91 = CAP CER 0.1UF 16V X7R 0402: as C2-C7 on sheet MIXR Processing - ESP32; Supplier 1: Digi-Key; Supplier Part Number 1: 490-10698-1-ND; Packaging: Tape and Reel; ComponentLink1URL: http://www.farnell.com/datasheets/2048008.pdf?src-supplier=Farnell; ComponentLink1Description: http://www.farnell.com/datasheets/2048008.pdf?src-supplier=Farnell; Tolerance: 10%; RoHS: Yes; Category: Ceramic Capacitors; Stock 1: 785540; Pricing 1: 1=0.10000, 10=0.03400, 100=0.01520, 500=0.01088, 1000=0.00855, 2500=0.00778, 5000=0.00715 (USD); Mount: Surface Mount; Case/Package: 0402; Weight: 0.000212oz; Case Code (Metric): 1005; Case Code (Imperial): 0402; Dielectric Material: Ceramic; Min Operating Temperature: -55°C; Max Operating Temperature: 125°C; Termination: SMD/SMT; Composition: Ceramic; Package Quantity: 10000; Length: 1mm; Height: 0.5mm; Width: 0.02inch; Thickness: 0.022inch; Depth: 0.5mm; REACH SVHC: Unknown; Lead Free: Lead Free; ComponentLink2URL: http://uk.rs-online.com/webdocs/144c/0900766b8144c113.pdf?src-supplier=RSComponents; ComponentLink2Description: http://uk.rs-online.com/webdocs/144c/0900766b8144c113.pdf?src-supplier=RSComponents; ComponentLink3URL: http://www.farnell.com/datasheets/1872206.pdf?src-supplier=Farnell; ComponentLink3Description: http://www.farnell.com/datasheets/1872206.pdf?src-supplier=Farnell; ComponentLink4URL: http://components.arrow.com/part/dataview/0323_06361249?src-supplier=Arrow+Europe; ComponentLink4Description: http://components.arrow.com/part/dataview/0323_06361249?src-supplier=Arrow+Europe; ComponentLink5URL: http://www.mouser.com/ds/2/281/c02e-2905.pdf?src-supplier=Mouser; ComponentLink5Description: http://www.mouser.com/ds/2/281/c02e-2905.pdf?src-supplier=Mouser; ComponentLink6URL: http://www.farnell.com/datasheets/2048008.pdf?src-supplier=Newark; ComponentLink6Description: http://www.farnell.com/datasheets/2048008.pdf?src-supplier=Newark; ComponentLink7URL: http://psearch.en.murata.com/capacitor/product/GRM155R71E104KE14%23.pdf?src-supplier=Avnet; ComponentLink7Description: http://psearch.en.murata.com/capacitor/product/GRM155R71E104KE14%23.pdf?src-supplier=Avnet; ComponentLink8URL: https://search.murata.co.jp/Ceramy/image/img/A01X/G101/ENG/GRM155R71E104KE14-01.pdf?src-supplier=Digi-Key; ComponentLink8Description: https://search.murata.co.jp/Ceramy/image/img/A01X/G101/ENG/GRM155R71E104KE14-01.pdf?src-supplier=Digi-Key; ComponentLink9URL: http://www.farnell.com/datasheets/2048008.pdf?src-supplier=Element14; ComponentLink9Description: http://www.farnell.com/datasheets/2048008.pdf?src-supplier=Element14; Dielectric: X7R; Voltage Rating (DC): 25V; Voltage Rating: 25V
R73 R74 = RES 10K OHM 1% 1/16W 0402: as R65 on sheet MIXR Processing - STM32 DSP Misc; Supplier 1: Digi-Key; RoHS: Yes; Category: Chip SMD Resistors; Stock 1: 60761136; Pricing 1: 1=0.10000, 10=0.01600, 100=0.00640, 1000=0.00289, 2500=0.00251, 5000=0.00207 (USD); Case/Package: 0402; Number of Pins: 2; Case Code (Imperial): 0402; Case Code (Metric): 1005; Min Operating Temperature: -55°C; Max Operating Temperature: 155°C; Packaging: Tape and Reel; Composition: Thick Film; Voltage Rating (DC): 50V; Termination: SMD/SMT; Military Standard: Not; Working Voltage: 50V; Number of Terminations: 2; Length: 1mm; Height: 0.32mm; Width: 0.5mm; Depth: 0.5mm; Lead Pitch: 0.2mm; REACH SVHC: No SVHC; Lead Free: Lead Free; ComponentLink1URL: https://datasheet.ciiva.com/7660/38568-7660787.pdf?src-supplier=Element14; ComponentLink1Description: https://datasheet.ciiva.com/7660/38568-7660787.pdf?src-supplier=Element14; ComponentLink2URL: https://datasheet.ciiva.com/7983/1018594-7983486.pdf?src-supplier=Element14; ComponentLink2Description: https://datasheet.ciiva.com/7983/1018594-7983486.pdf?src-supplier=Element14; ComponentLink3URL: https://datasheet.ciiva.com/7849/1784430-7849813.pdf?src-supplier=Element14; ComponentLink3Description: https://datasheet.ciiva.com/7849/1784430-7849813.pdf?src-supplier=Element14; ComponentLink4URL: https://datasheet.ciiva.com/7849/1686128-7849814.pdf?src-supplier=Element14; ComponentLink4Description: https://datasheet.ciiva.com/7849/1686128-7849814.pdf?src-supplier=Element14; ComponentLink5URL: https://datasheet.ciiva.com/7849/1784430-7849815.pdf?src-supplier=Element14; ComponentLink5Description: https://datasheet.ciiva.com/7849/1784430-7849815.pdf?src-supplier=Element14; ComponentLink6URL: https://datasheet.ciiva.com/22747/1018594-22747512.pdf?src-supplier=Element14; ComponentLink6Description: https://datasheet.ciiva.com/22747/1018594-22747512.pdf?src-supplier=Element14; ComponentLink7URL: https://datasheet.ciiva.com/12667/pyu-rc0402-51-rohs-l-6-r-12667067.pdf?src-supplier=Mouser; ComponentLink7Description: https://datasheet.ciiva.com/12667/pyu-rc0402-51-rohs-l-6-r-12667067.pdf?src-supplier=Mouser; Supplier Part Number 1: 311-10.0KLRCT-ND
U13 = IC FLASH NOR 512Mb SPI 166MHz 16-SOP: FLASH - NOR Memory IC 512Mb (64M x 8) SPI 166MHz 16-SOP; Manufacturer: Macronix; Supplier 1: Digi-Key; RoHS: No; Stock 1: 1057; Pricing 1: 1=6.92000, 10=6.36900, 25=6.23640, 50=6.21440, 100=5.57500, 250=5.40592, 500=5.14132, 1000=4.96125 (USD); Supplier Part Number 1: 1092-1245-ND

## Sheet MIXR Input and Processing - Block Diagram.SchDoc: MIXR Input & Processing - Block Diagram
size B; Organization: Midnight Sun Solar Rayce Car Team; Address1: University of Waterloo; Address2: 200 University Ave W; Address3: Waterloo, ON, Canada; Address4: N2L 3E9; DocumentNumber: 1; SheetNumber: 1; SheetTotal: 15; Website: www.uwmidsun.com; ProjectName: ProjectName

### Notes on the sheet
- PROJECT
- DOCUMENT
- DRAWN BY
- LAST MODIFIED
- PART NUMBER
- REVISION
- SHEET
- VARIANT
- OF

## Nets that join several sheets
3V3: MIXR Processing - STM32 USB-UART Converter (5 pins), MIXR Processing - ESP32 (10 pins), MIXR Processing - ESP32 Peripherals (5 pins), MIXR Input - ADC Power & Communication (R62.9 R62.10 R62.14), MIXR Processing - STM32 DSP Misc (42 pins), MIXR Input - Board to Board Connectors (5 pins), MIXR Processing - STM32 NOR Flash (C91.1 R73.1 R74.1 U13.2)
3V3_SW: MIXR Processing - USB Hub (15 pins), MIXR Processing - SD Card (9 pins), MIXR Input - ADC Power & Communication (C63.1 C64.1 C65.1 U8.14), MIXR Input - Board to Board Connectors (5 pins)
48V_SW: MIXR Processing - ESP32 (R10.1), MIXR Input - Instrument Inputs (R41.1 R42.1), MIXR Input - Board to Board Connectors (C94.1 P5.7)
+5V_SW: MIXR Processing - ESP32 (R11.1), MIXR Input - Instrument 1 Filtering & ADC (6 pins), MIXR Input - Instrument 0 Filtering & ADC (6 pins), MIXR Input - ADC Power & Communication (C66.1 C67.1 C68.1 U8.22), MIXR Input - Board to Board Connectors (C90.1 P5.4)
-5V_SW: MIXR Input - Instrument 1 Filtering & ADC (5 pins), MIXR Input - Instrument 0 Filtering & ADC (5 pins), MIXR Input - Board to Board Connectors (C92.1 P5.5)
GND: MIXR Processing - USB Hub (23 pins), MIXR Processing - STM32 USB-UART Converter (5 pins), MIXR Processing - STM32 DSP Microcontroller (5 pins), MIXR Processing - SD Card (16 pins), MIXR Processing - ESP32 (19 pins), MIXR Processing - ESP32 Peripherals (5 pins), MIXR Input - Instrument Inputs (14 pins), MIXR Input - Instrument 1 Filtering & ADC (18 pins), MIXR Input - Instrument 0 Filtering & ADC (18 pins), MIXR Input - ADC Power & Communication (13 pins), MIXR Processing - STM32 DSP Misc (46 pins), MIXR Input - Board to Board Connectors (16 pins), MIXR Processing - STM32 NOR Flash (C91.2 U13.10)
VBUS_DEBUG_PROT: MIXR Processing - USB Hub (F1.2 LED2.1 R33.1), MIXR Processing - STM32 USB-UART Converter (R31.1), MIXR Processing - STM32 DSP Microcontroller (U5.124), MIXR Processing - ESP32 Peripherals (R22.1)
ESP32_EN: MIXR Processing - ESP32 (5 pins), MIXR Processing - ESP32 Peripherals (Q1.3)
ESP32_GPIO0: MIXR Processing - ESP32 (5 pins), MIXR Processing - ESP32 Peripherals (Q2.3)
ESP32_IO18_INTERFACE_I2C_PE_INT: MIXR Processing - ESP32 (U1.30), MIXR Input - Board to Board Connectors (C95.1 P7.3)
ESP32_IO19_I2C2_SDA: MIXR Processing - ESP32 (R5.2 R63.2 U1.31), MIXR Input - Board to Board Connectors (P7.2)
ESP32_IO21_I2C1_SDA: MIXR Processing - ESP32 (R2.2 R63.1 U1.33), MIXR Input - Board to Board Connectors (P5.13)
ESP32_IO22_I2C1_SCL: MIXR Processing - ESP32 (R3.2 R64.1 U1.36), MIXR Input - Board to Board Connectors (P5.14)
ESP32_IO23_I2C2_SCL: MIXR Processing - ESP32 (R4.2 R64.2 U1.37), MIXR Input - Board to Board Connectors (P7.1)
ESP32_IO25_DSP_SD_CARD_ACCESS_EN: MIXR Processing - STM32 DSP Microcontroller (U5.157), MIXR Processing - SD Card (R17.2 U2.1 U3.1), MIXR Processing - ESP32 (U1.10)
ESP32_IO26_POWER_I2C_PE_INT: MIXR Processing - ESP32 (U1.11), MIXR Input - Board to Board Connectors (P5.12)
ESP32_IO36_POWER_BUTTON: MIXR Processing - ESP32 (U1.4), MIXR Input - Board to Board Connectors (C96.1 P7.4)
ESP32_IO39_nSD_CARD_DETECTED: MIXR Processing - SD Card (D1.13 R15.1 R16.2), MIXR Processing - ESP32 (U1.5)
ESP32_PROG_UART0_RX: MIXR Processing - ESP32 (P9.2 U1.34), MIXR Processing - ESP32 Peripherals (R20.2)
ESP32_PROG_UART0_TX: MIXR Processing - ESP32 (P9.1 R7.1), MIXR Processing - ESP32 Peripherals (U4.25)
ESP32_SD_D1: MIXR Processing - SD Card (U2.2), MIXR Processing - ESP32 (U1.26)
ESP32_SD_D2: MIXR Processing - SD Card (U3.11), MIXR Processing - ESP32 (U1.14)
ESP32_SD_D3: MIXR Processing - SD Card (U3.5), MIXR Processing - ESP32 (U1.16)
ESP32_SD_MISO_D0: MIXR Processing - SD Card (U2.5), MIXR Processing - ESP32 (R12.2 U1.24)
ESP32_SD_MOSI_CMD: MIXR Processing - SD Card (U3.2), MIXR Processing - ESP32 (U1.23)
ESP32_SD_SCK_CLK: MIXR Processing - SD Card (U2.11), MIXR Processing - ESP32 (U1.13)
INST_0_CLIPPING: MIXR Processing - STM32 DSP Microcontroller (U5.43), MIXR Input - Instrument 0 Filtering & ADC (R46.1 U8.21), MIXR Input - Board to Board Connectors (C97.1 P6.3)
INST_1/MIC_CLIPPING: MIXR Processing - STM32 DSP Microcontroller (U5.44), MIXR Input - Instrument 1 Filtering & ADC (R54.1 U8.20), MIXR Input - Board to Board Connectors (C98.1 P6.4)
STM32_PA2_UART2_TX_ESP32_RX: MIXR Processing - STM32 DSP Microcontroller (R24.1), MIXR Processing - ESP32 (P10.2 U1.27)
STM32_PA3_UART2_RX_ESP32_TX: MIXR Processing - STM32 DSP Microcontroller (U5.47), MIXR Processing - ESP32 (P10.1 R8.1)
STM32_PA4_I2S1_WS: MIXR Processing - STM32 DSP Microcontroller (R25.1), MIXR Input - ADC Power & Communication (U8.17)
STM32_PA5_I2S1_CK: MIXR Processing - STM32 DSP Microcontroller (R26.1), MIXR Input - ADC Power & Communication (U8.16)
STM32_PA7_I2S1_SD: MIXR Processing - STM32 DSP Microcontroller (U5.53), MIXR Input - ADC Power & Communication (R61.2)
STM32_PA13_SWDIO: MIXR Processing - STM32 DSP Microcontroller (U5.128), MIXR Processing - STM32 DSP Misc (J1.2)
STM32_PA14_SWCLK: MIXR Processing - STM32 DSP Microcontroller (U5.137), MIXR Processing - STM32 DSP Misc (J1.4)
STM32_PB0_ADC_nRESET: MIXR Processing - STM32 DSP Microcontroller (R27.1), MIXR Input - ADC Power & Communication (R62.8 U8.19)
STM32_PB6_QSPI_BK1_NCS: MIXR Processing - STM32 DSP Microcontroller (R28.1), MIXR Processing - STM32 NOR Flash (R73.2 U13.7)
STM32_PB14_DEBUG_UART1_TX: MIXR Processing - STM32 USB-UART Converter (U6.25), MIXR Processing - STM32 DSP Microcontroller (R67.1), MIXR Processing - STM32 DSP Misc (J1.6)
STM32_PB15_DEBUG_UART1_RX: MIXR Processing - STM32 USB-UART Converter (R30.2), MIXR Processing - STM32 DSP Microcontroller (U5.88), MIXR Processing - STM32 DSP Misc (J1.8)
STM32_PC4_I2S1_MCK: MIXR Processing - STM32 DSP Microcontroller (R69.1), MIXR Input - ADC Power & Communication (U8.18)
STM32_PD6_SDMMC2_CK: MIXR Processing - STM32 DSP Microcontroller (U5.150), MIXR Processing - SD Card (U2.10)
STM32_PD7_SDMMC2_CMD: MIXR Processing - STM32 DSP Microcontroller (U5.151), MIXR Processing - SD Card (U3.3)
STM32_PF5_FLASH_nRESET: MIXR Processing - STM32 DSP Microcontroller (U5.21), MIXR Processing - STM32 NOR Flash (R74.2 U13.3)
STM32_PF6_QSPI_BK1_IO3: MIXR Processing - STM32 DSP Microcontroller (U5.24), MIXR Processing - STM32 NOR Flash (U13.1)
STM32_PF7_QSPI_BK1_IO2: MIXR Processing - STM32 DSP Microcontroller (U5.25), MIXR Processing - STM32 NOR Flash (U13.9)
STM32_PF8_QSPI_BK1_IO0: MIXR Processing - STM32 DSP Microcontroller (U5.26), MIXR Processing - STM32 NOR Flash (U13.15)
STM32_PF9_QSPI_BK1_IO1: MIXR Processing - STM32 DSP Microcontroller (U5.27), MIXR Processing - STM32 NOR Flash (U13.8)
STM32_PF10_QSPI_CLK: MIXR Processing - STM32 DSP Microcontroller (R72.2), MIXR Processing - STM32 NOR Flash (U13.16)
STM32_PG9_SDMMC2_D0: MIXR Processing - STM32 DSP Microcontroller (U5.152), MIXR Processing - SD Card (U2.6)
STM32_PG10_SDMMC2_D1: MIXR Processing - STM32 DSP Microcontroller (U5.153), MIXR Processing - SD Card (U2.3)
STM32_PG11_SDMMC2_D2: MIXR Processing - STM32 DSP Microcontroller (U5.154), MIXR Processing - SD Card (U3.10)
STM32_PG12_SDMMC2_D3: MIXR Processing - STM32 DSP Microcontroller (U5.155), MIXR Processing - SD Card (U3.6)
STM32_PG13_SD_DETECT: MIXR Processing - STM32 DSP Microcontroller (U5.156), MIXR Processing - SD Card (R16.1)
USB_ESP32_D_N: MIXR Processing - USB Hub (U7.3), MIXR Processing - ESP32 Peripherals (U4.5)
USB_ESP32_D_P: MIXR Processing - USB Hub (U7.4), MIXR Processing - ESP32 Peripherals (U4.4)
USB_STM32_D_N: MIXR Processing - USB Hub (U7.6), MIXR Processing - STM32 USB-UART Converter (U6.5)
USB_STM32_D_P: MIXR Processing - USB Hub (U7.7), MIXR Processing - STM32 USB-UART Converter (U6.4)
USB_STM32_USB_FS_D_N: MIXR Processing - USB Hub (U7.12), MIXR Processing - STM32 DSP Microcontroller (U5.126)
USB_STM32_USB_FS_D_P: MIXR Processing - USB Hub (U7.13), MIXR Processing - STM32 DSP Microcontroller (U5.127)
VIN_INST_0_NEG: MIXR Input - Instrument Inputs (D4.1 P3.3 P3.5 R40.1), MIXR Input - Instrument 0 Filtering & ADC (R49.1)
VIN_INST_0_POS: MIXR Input - Instrument Inputs (5 pins), MIXR Input - Instrument 0 Filtering & ADC (R47.1)
VIN_INST_1_NEG: MIXR Input - Instrument Inputs (C28.2 D6.1 P4.5 R44.1), MIXR Input - Instrument 1 Filtering & ADC (R57.1)
VIN_INST_1_POS: MIXR Input - Instrument Inputs (5 pins), MIXR Input - Instrument 1 Filtering & ADC (R55.1)

## Assembly variants
Standard: not fitted C91 P8 P9 P10 R63 R64 R73 R74 U13